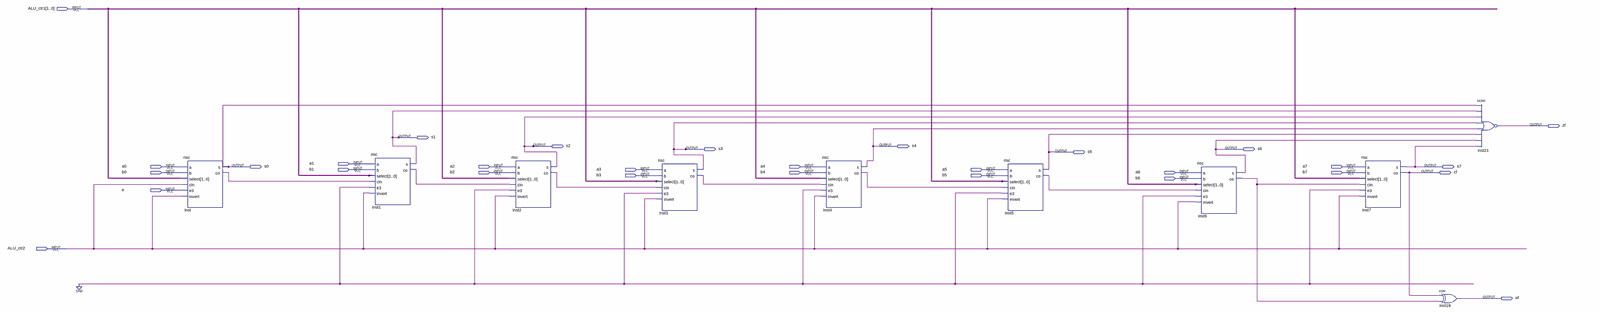
[diagram p0: schematic sheet, whole]
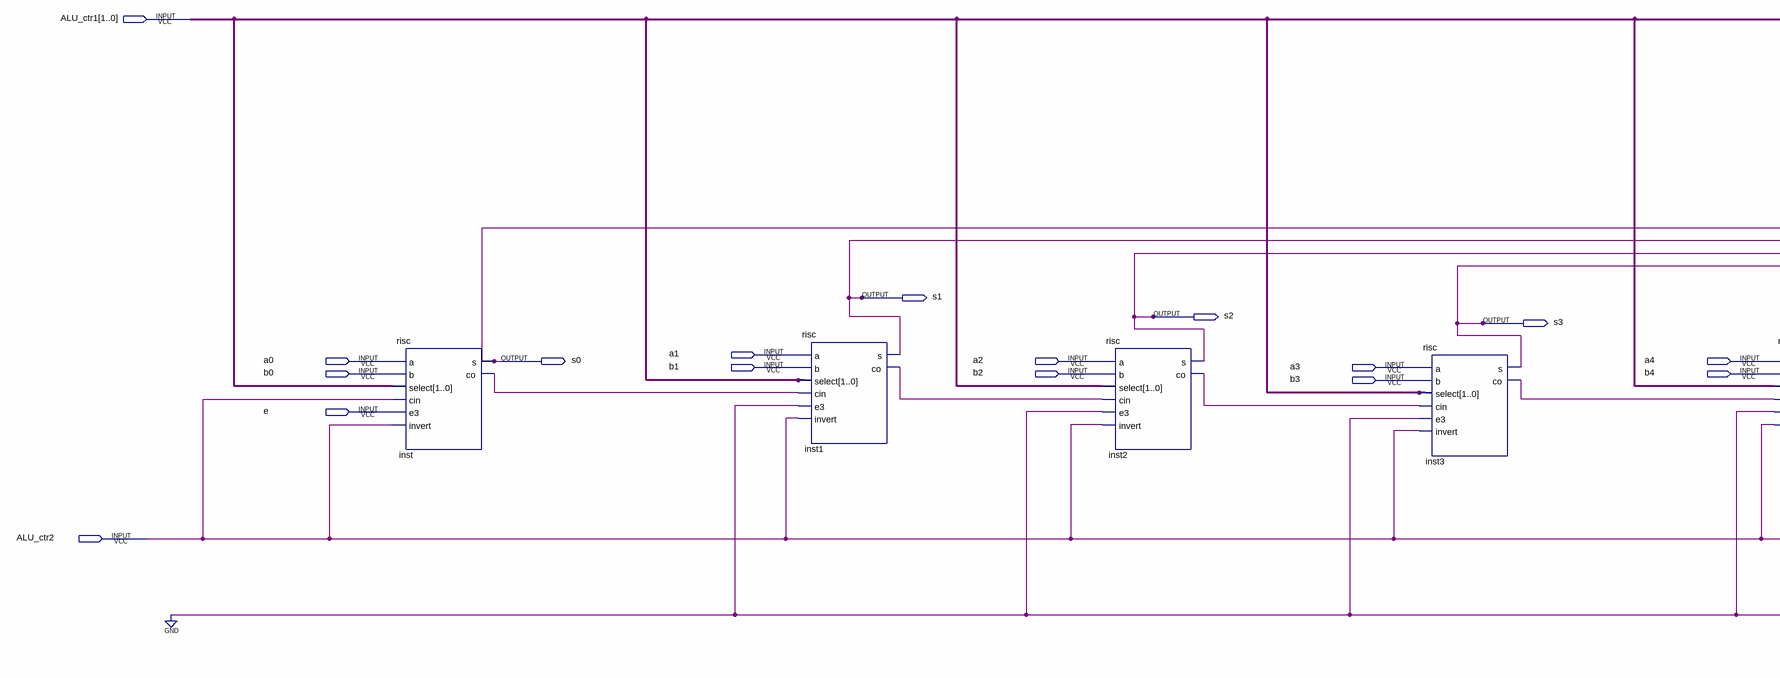
[diagram p1: schematic sheet, left part]
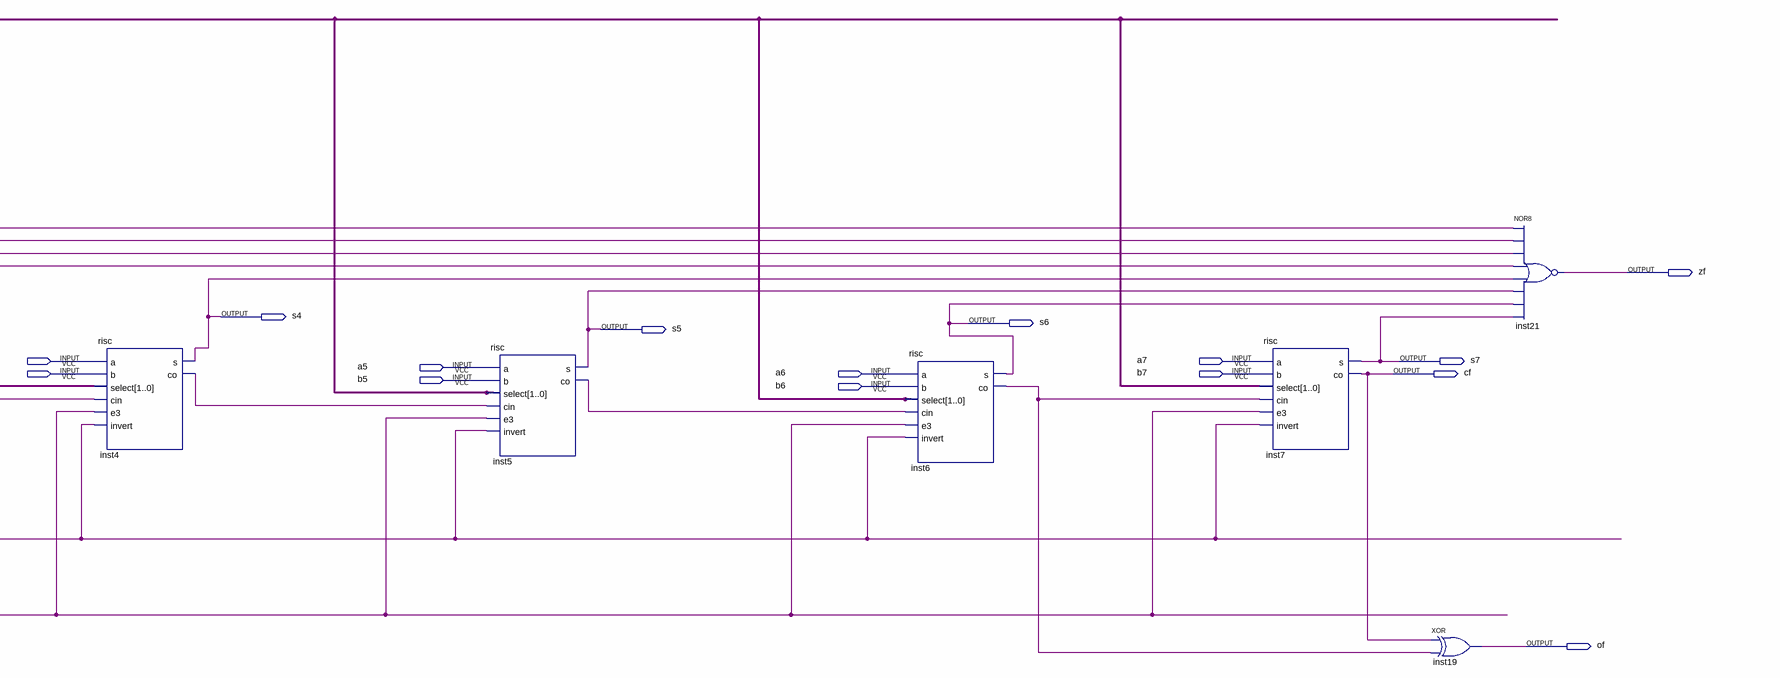
[diagram p2: schematic sheet, right part]
// Quartus schematic risc8.bdf as structural Verilog: 10 symbols, 30 pins
module risc8 (
  input  [1:0] ALU_ctr1,
  input  a1,
  input  a0,
  input  a2,
  input  a4,
  input  a7,
  input  b1,
  input  a3,
  input  a5,
  input  b0,
  input  b2,
  input  b4,
  input  a6,
  input  b7,
  input  b3,
  input  b5,
  input  b6,
  input  e,
  input  ALU_ctr2,
  output zf,
  output s1,
  output s2,
  output s4,
  output s3,
  output s6,
  output s5,
  output s0,
  output s7,
  output cf,
  output of
);

  wire inst1_co, inst2_co, inst3_co, inst4_co, inst5_co, inst6_co, inst_co;

  risc inst (.a(a0), .b(b0), .select(ALU_ctr1), .cin(ALU_ctr2), .e3(e), .invert(ALU_ctr2), .s(s0), .co(inst_co));
  risc inst1 (.a(a1), .b(b1), .select(ALU_ctr1), .cin(inst_co), .e3(1'b0), .invert(ALU_ctr2), .s(s1), .co(inst1_co));
  risc inst2 (.a(a2), .b(b2), .select(ALU_ctr1), .cin(inst1_co), .e3(1'b0), .invert(ALU_ctr2), .s(s2), .co(inst2_co));
  risc inst3 (.a(a3), .b(b3), .select(ALU_ctr1), .cin(inst2_co), .e3(1'b0), .invert(ALU_ctr2), .s(s3), .co(inst3_co));
  risc inst4 (.a(a4), .b(b4), .select(ALU_ctr1), .cin(inst3_co), .e3(1'b0), .invert(ALU_ctr2), .s(s4), .co(inst4_co));
  risc inst5 (.a(a5), .b(b5), .select(ALU_ctr1), .cin(inst4_co), .e3(1'b0), .invert(ALU_ctr2), .s(s5), .co(inst5_co));
  risc inst6 (.a(a6), .b(b6), .select(ALU_ctr1), .cin(inst5_co), .e3(1'b0), .invert(ALU_ctr2), .s(s6), .co(inst6_co));
  risc inst7 (.select(ALU_ctr1), .cin(inst6_co), .e3(1'b0), .invert(ALU_ctr2), .s(s7), .co(cf));  // open: a, b
  xor inst19 (of, cf, inst6_co);
  nor inst21 (zf, s0, s1, s2, s3, s4, s5, s6, s7);
endmodule
